# Altium schematic sheet main.SchDoc
size Letter; SheetNumber: 1; SheetTotal: 1
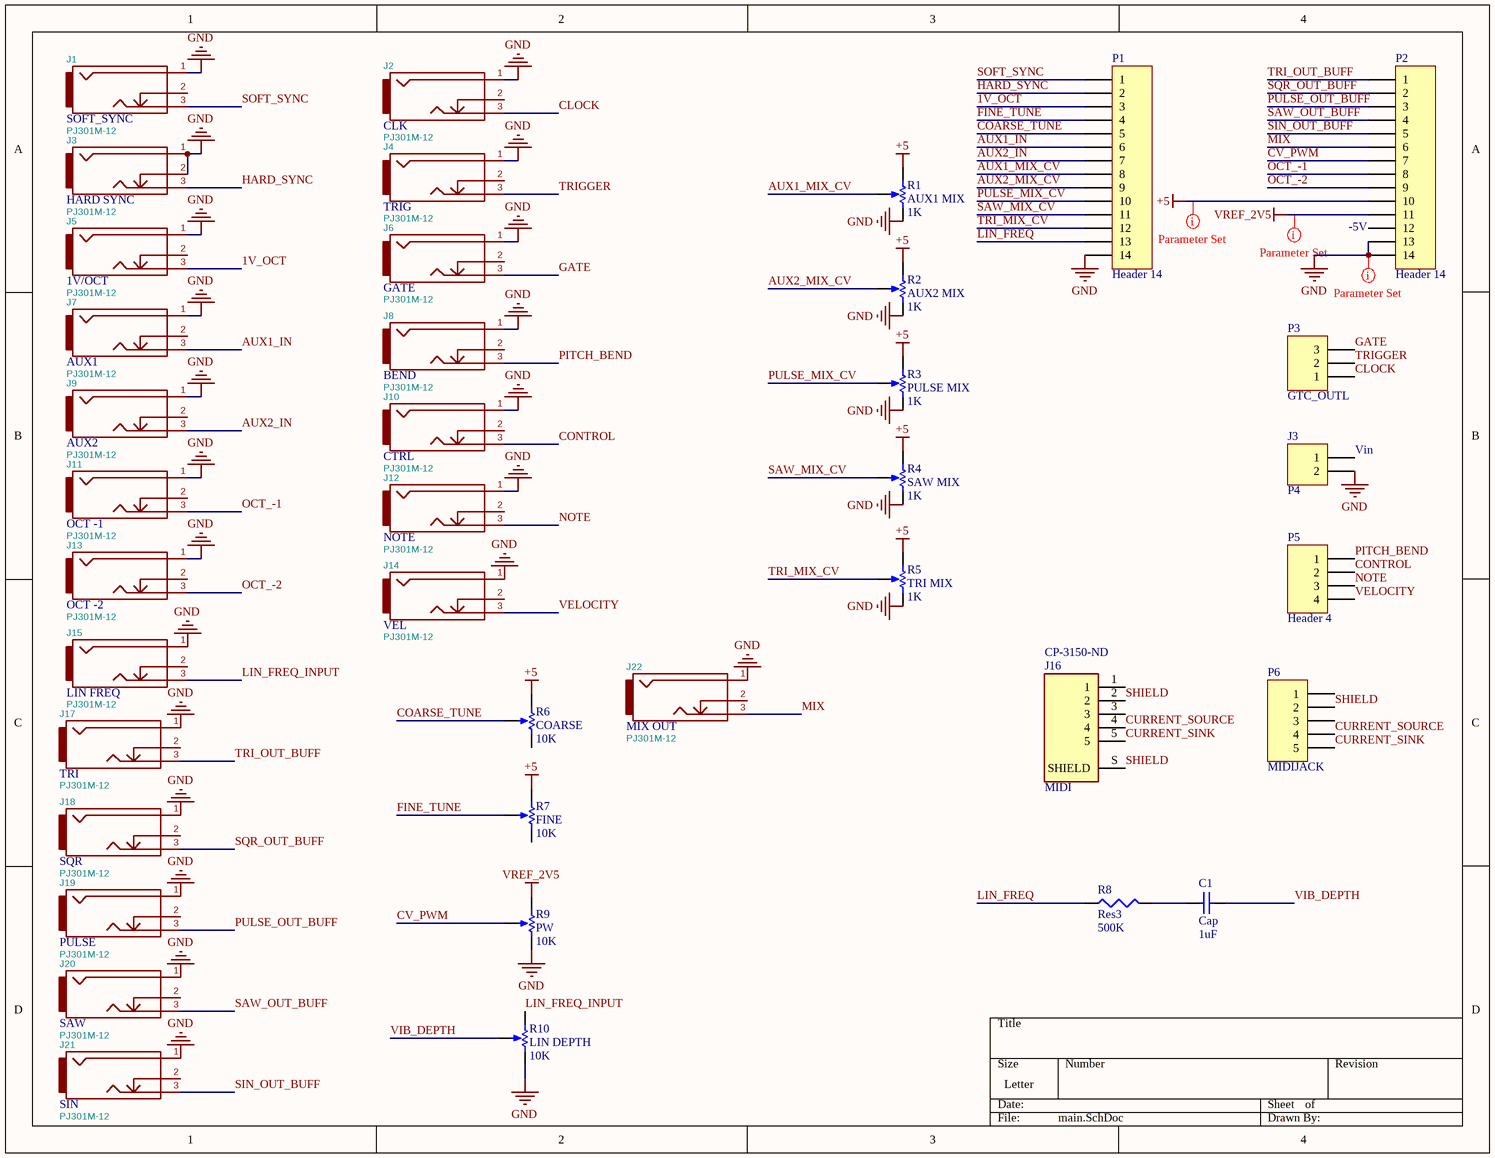
[diagram p0: main.SchDoc]

## Parts
C1  Cap  value 1uF  [C1206]
J1  SOFT_SYNC  value PJ301M-12  [PJ301M-12]
J2  CLK  value PJ301M-12  [PJ301M-12]
J3  HARD SYNC  value PJ301M-12  [PJ301M-12]
J4  TRIG  value PJ301M-12  [PJ301M-12]
J5  1V/OCT  value PJ301M-12  [PJ301M-12]
J6  GATE  value PJ301M-12  [PJ301M-12]
J7  AUX1  value PJ301M-12  [PJ301M-12]
J8  BEND  value PJ301M-12  [PJ301M-12]
J9  AUX2  value PJ301M-12  [PJ301M-12]
J10  CTRL  value PJ301M-12  [PJ301M-12]
J11  OCT -1  value PJ301M-12  [PJ301M-12]
J12  NOTE  value PJ301M-12  [PJ301M-12]
J13  OCT -2  value PJ301M-12  [PJ301M-12]
J14  VEL  value PJ301M-12  [PJ301M-12]
J15  LIN FREQ  value PJ301M-12  [PJ301M-12]
J16  MIDI  Supplier Part Number 1: CP-3150-ND  [CUI_SD-50BV]
J17  TRI  value PJ301M-12  [PJ301M-12]
J18  SQR  value PJ301M-12  [PJ301M-12]
J19  PULSE  value PJ301M-12  [PJ301M-12]
J20  SAW  value PJ301M-12  [PJ301M-12]
J21  SIN  value PJ301M-12  [PJ301M-12]
J22  MIX OUT  value PJ301M-12  [PJ301M-12]
P1  Header 14  [HDR1X14]
P2  Header 14  [HDR1X14]
P3  GTC_OUTL  [HDR1X3]
P4  J3  [HDR1X2]
P5  Header 4  [HDR1X4]
P6  MIDIJACK  [HDR1X5]
R1  AUX1 MIX  value 1K  [Alpha9mmPot]
R2  AUX2 MIX  value 1K  [Alpha9mmPot]
R3  PULSE MIX  value 1K  [Alpha9mmPot]
R4  SAW MIX  value 1K  [Alpha9mmPot]
R5  TRI MIX  value 1K  [Alpha9mmPot]
R6  COARSE  value 10K  [Alpha9mmPot]
R7  FINE  value 10K  [Alpha9mmPot]
R8  Res3  value 500K  [C1206]
R9  PW  value 10K  [Alpha9mmPot]
R10  LIN DEPTH  value 10K  [Alpha9mmPot]

## Nets
+5: P2.10 R1.1(TOP) R2.1(TOP) R3.1(TOP) R4.1(TOP) R5.1(TOP) R6.1(TOP) R7.1(TOP)
GND: J1.1 J2.1 J3.1 J3.2 J4.1 J5.1 J6.1 J7.1 J8.1 J9.1 J10.1 J11.1 J12.1 J13.1 J14.1 J15.1 J17.1 J18.1 J19.1 J20.1 J21.1 J22.1 P1.14 P2.13 P2.14 P4.2 R1.2(BOT) R2.2(BOT) R3.2(BOT) R4.2(BOT) R5.2(BOT) R9.2(BOT) R10.2(BOT)
VREF_2V5: P2.11 R9.1(TOP)
1V_OCT: J5.3 P1.3
AUX1_IN: J7.3 P1.6
AUX1_MIX_CV: P1.8 R1.3(TAP)
AUX2_IN: J9.3 P1.7
AUX2_MIX_CV: P1.9 R2.3(TAP)
CLOCK: J2.3 P3.1
COARSE_TUNE: P1.5 R6.3(TAP)
CONTROL: J10.3 P5.2
CURRENT_SINK: J16.5 P6.5
CURRENT_SOURCE: J16.4 P6.4
CV_PWM: P2.7 R9.3(TAP)
FINE_TUNE: P1.4 R7.3(TAP)
GATE: J6.3 P3.3
HARD_SYNC: J3.3 P1.2
LIN_FREQ: P1.13 R8.1
LIN_FREQ_INPUT: J15.3 R10.1(TOP)
MIX: J22.3 P2.6
NOTE: J12.3 P5.3
OCT_-1: J11.3 P2.8
OCT_-2: J13.3 P2.9
PITCH_BEND: J8.3 P5.1
PULSE_MIX_CV: P1.10 R3.3(TAP)
PULSE_OUT_BUFF: J19.3 P2.3
SAW_MIX_CV: P1.11 R4.3(TAP)
SAW_OUT_BUFF: J20.3 P2.4
SHIELD: J16.2 J16.S(SHIELD) P6.2
SIN_OUT_BUFF: J21.3 P2.5
SOFT_SYNC: J1.3 P1.1
SQR_OUT_BUFF: J18.3 P2.2
TRI_MIX_CV: P1.12 R5.3(TAP)
TRI_OUT_BUFF: J17.3 P2.1
TRIGGER: J4.3 P3.2
VELOCITY: J14.3 P5.4
VIB_DEPTH: C1.2 R10.3(TAP)
NetC1_1: C1.1 R8.2

Not connected (* = marked no-connect by the designer): J1 2; J2 2; J4 2; J5 2; J6 2; J7 2; J8 2; J9 2; J10 2; J11 2; J12 2; J13 2; J14 2; J15 2; J16 1 3; J17 2; J18 2; J19 2; J20 2; J21 2; J22 2; P2 12; P4 1; P6 1 3; R6 2(BOT); R7 2(BOT)

## Layout directives
rule Width Constraint [Pref Width = 15mil    Min Width = 15mil    Max Width = 15mil]: +5, GND, VREF_2V5

## Notes on the sheet
- (near P2) -5V
- (near P4) Vin

## Library data of the parts
C1 = Cap: Capacitor; Published: 8-Jun-2000; LatestRevisionDate: 17-Jul-2002; LatestRevisionNote: Re-released for DXP Platform.; PackageReference: RAD-0.3; Publisher: Altium Limited; PackageDescription: Radial Cap, Thru-Hole; 2 Leads; 0.3 in Pin Spacing
J1-J15 J17-J22 = PJ301M-12
J16 = SD-50BV: 3~8 Positions, Receptacle, Vertical, Through Hole, Shielded, Standard Circular DIN Connector; MF: CUI Devices; SnapEDA_Link: https://www.snapeda.com/parts/SD-50BV/CUI%20Devices/view-part/447142/?ref=snap; Package: None; Availability: Unavailable; Price: None; MP: SD-50BV; Value: *; Supplier 1: Digi-Key
P1 P2 = Header 14: Header, 14-Pin; LatestRevisionDate: 17-Jul-2002; LatestRevisionNote: Re-released for DXP Platform.; Publisher: Altium Limited
P3 = Header 3: Header, 3-Pin; LatestRevisionDate: 17-Jul-2002; LatestRevisionNote: Re-released for DXP Platform.; Publisher: Altium Limited
P4 = Header 2: Header, 2-Pin; LatestRevisionDate: 17-Jul-2002; LatestRevisionNote: Re-released for DXP Platform.; Publisher: Altium Limited
P5 = Header 4: Header, 4-Pin; LatestRevisionDate: 17-Jul-2002; LatestRevisionNote: Re-released for DXP Platform.; Publisher: Altium Limited
P6 = Header 5: Header, 5-Pin; LatestRevisionDate: 17-Jul-2002; LatestRevisionNote: Re-released for DXP Platform.; Publisher: Altium Limited
R1-R7 R9 R10 = RPot: Potentiometer; Sim Note: Enter the Resistance value and the set point into parameter fields.; Set Position: 0.5; Published: 8-Jun-2000; LatestRevisionDate: 17-Jul-2002; LatestRevisionNote: Re-released for DXP Platform.; PackageReference: VR5; Publisher: Altium Limited; PackageDescription: Variable Resistor, Thru-Hole; 3 Leads
R8 = Res3: Resistor; Published: 8-Jun-2000; LatestRevisionDate: 29-May-2009; LatestRevisionNote: IPC-7351 Footprint Added.; PackageReference: J1-0603; Publisher: Altium Limited; PackageDescription: Chip Resistor